# Altium schematic sheet STM-connections.SchDoc
size A4; Organization: Altium Limited; Address1: L3, 12a Rodborough Rd; Address2: Frenchs Forest; Address3: NSW; Address4: Australia 2086
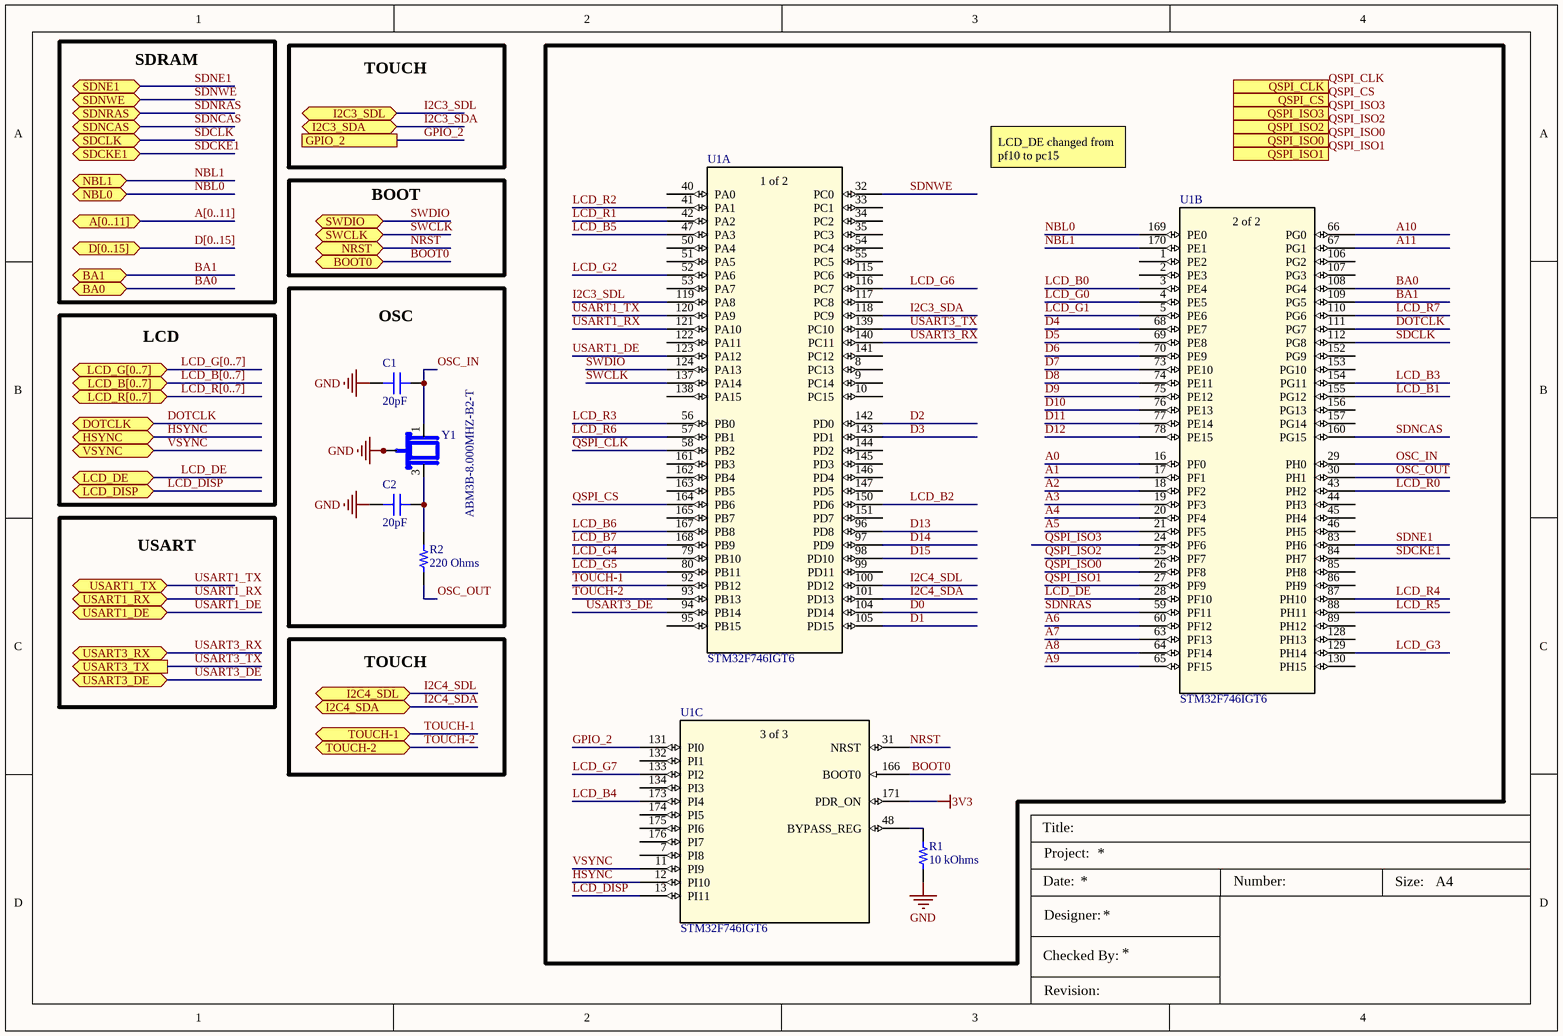
[diagram p0: STM-connections.SchDoc]

## Parts
C1  20pF  [CAP 0603_1608]
C2  20pF  [CAP 0603_1608]
R1  10 kOhms  [RES 0603_1608]
R2  220 Ohms  [RES 0603_1608]
U1  STM32F746IGT6  [LQFP176_24X24_STM]  (parts A,B,C of 4)
Y1  ABM3B-8.000MHZ-B2-T  [OSC_ABM3B-8.000MHZ-B2-T]

## Blocks framed on the sheet
OSC: C1 C2 R2 Y1

## Ports
A[0..11] (bidir), BA0 (bidir), BA1 (bidir), BOOT0 (bidir), D[0..15] (bidir), DOTCLK (bidir), GPIO_2, HSYNC (bidir), I2C3_SDA (bidir), I2C3_SDL (bidir), I2C4_SDA (bidir), I2C4_SDL (bidir), LCD_B[0..7] (bidir), LCD_DE (bidir), LCD_DISP (bidir), LCD_G[0..7] (bidir), LCD_R[0..7] (bidir), NBL0 (bidir), NBL1 (bidir), NRST (bidir), QSPI_CLK, QSPI_CS, QSPI_ISO0, QSPI_ISO1, QSPI_ISO2, QSPI_ISO3, SDCKE1 (bidir), SDCLK (bidir), SDNCAS (bidir), SDNE1 (bidir), SDNRAS (bidir), SDNWE (bidir), SWCLK (bidir), SWDIO (bidir), TOUCH-1 (bidir), TOUCH-2 (bidir), USART1_DE (bidir), USART1_RX (bidir), USART1_TX (bidir), USART3_DE (bidir), USART3_RX (bidir), USART3_TX (out), VSYNC (bidir)

## Nets
3V3: U1.171(PDR_ON)
GND: C1.1 C2.1 R1.1 Y1.2(GND) Y1.4(GND)
A0: U1.16(PF0)
A1: U1.17(PF1)
A2: U1.18(PF2)
A3: U1.19(PF3)
A4: U1.20(PF4)
A5: U1.21(PF5)
A6: U1.60(PF12)
A7: U1.63(PF13)
A8: U1.64(PF14)
A9: U1.65(PF15)
A10: U1.66(PG0)
A11: U1.67(PG1)
BA0: U1.108(PG4) ; port BA0
BA1: U1.109(PG5) ; port BA1
BOOT0: U1.166(BOOT0) ; port BOOT0
D0: U1.104(PD14)
D1: U1.105(PD15)
D2: U1.142(PD0)
D3: U1.143(PD1)
D4: U1.68(PE7)
D5: U1.69(PE8)
D6: U1.70(PE9)
D7: U1.73(PE10)
D8: U1.74(PE11)
D9: U1.75(PE12)
D10: U1.76(PE13)
D11: U1.77(PE14)
D12: U1.78(PE15)
D13: U1.96(PD8)
D14: U1.97(PD9)
D15: U1.98(PD10)
DOTCLK: U1.111(PG7) ; port DOTCLK
GPIO_2: U1.131(PI0) ; port GPIO_2
HSYNC: U1.12(PI10) ; port HSYNC
I2C3_SDA: U1.118(PC9) ; port I2C3_SDA
I2C3_SDL: U1.119(PA8) ; port I2C3_SDL
I2C4_SDA: U1.101(PD13) ; port I2C4_SDA
I2C4_SDL: U1.100(PD12) ; port I2C4_SDL
LCD_B0: U1.3(PE4)
LCD_B1: U1.155(PG12)
LCD_B2: U1.150(PD6)
LCD_B3: U1.154(PG11)
LCD_B4: U1.173(PI4)
LCD_B5: U1.47(PA3)
LCD_B6: U1.167(PB8)
LCD_B7: U1.168(PB9)
LCD_DE: U1.28(PF10) ; port LCD_DE
LCD_DISP: U1.13(PI11) ; port LCD_DISP
LCD_G0: U1.4(PE5)
LCD_G1: U1.5(PE6)
LCD_G2: U1.52(PA6)
LCD_G3: U1.129(PH14)
LCD_G4: U1.79(PB10)
LCD_G5: U1.80(PB11)
LCD_G6: U1.116(PC7)
LCD_G7: U1.133(PI2)
LCD_R0: U1.43(PH2)
LCD_R1: U1.42(PA2)
LCD_R2: U1.41(PA1)
LCD_R3: U1.56(PB0)
LCD_R4: U1.87(PH10)
LCD_R5: U1.88(PH11)
LCD_R6: U1.57(PB1)
LCD_R7: U1.110(PG6)
NBL0: U1.169(PE0) ; port NBL0
NBL1: U1.170(PE1) ; port NBL1
NRST: U1.31(NRST) ; port NRST
OSC_IN: C1.2 U1.29(PH0) Y1.1
OSC_OUT: R2.2 U1.30(PH1)
QSPI_CLK: U1.58(PB2) ; port QSPI_CLK
QSPI_CS: U1.164(PB6) ; port QSPI_CS
QSPI_ISO0: U1.26(PF8) ; port QSPI_ISO0
QSPI_ISO1: U1.27(PF9) ; port QSPI_ISO1
QSPI_ISO2: U1.25(PF7) ; port QSPI_ISO2
QSPI_ISO3: U1.24(PF6) ; port QSPI_ISO3
SDCKE1: U1.84(PH7) ; port SDCKE1
SDCLK: U1.112(PG8) ; port SDCLK
SDNCAS: U1.160(PG15) ; port SDNCAS
SDNE1: U1.83(PH6) ; port SDNE1
SDNRAS: U1.59(PF11) ; port SDNRAS
SDNWE: U1.32(PC0) ; port SDNWE
SWCLK: U1.137(PA14) ; port SWCLK
SWDIO: U1.124(PA13) ; port SWDIO
TOUCH-1: U1.92(PB12) ; port TOUCH-1
TOUCH-2: U1.93(PB13) ; port TOUCH-2
USART1_DE: U1.123(PA12) ; port USART1_DE
USART1_RX: U1.121(PA10) ; port USART1_RX
USART1_TX: U1.120(PA9) ; port USART1_TX
USART3_DE: U1.94(PB14) ; port USART3_DE
USART3_RX: U1.140(PC11) ; port USART3_RX
USART3_TX: U1.139(PC10) ; port USART3_TX
VSYNC: U1.11(PI9) ; port VSYNC
NetC2_2: C2.2 R2.1 Y1.3
NetR1_2: R1.2 U1.48(BYPASS_REG)

Not connected (* = marked no-connect by the designer): U1 1(PE2) 2(PE3) 7(PI8) 8(PC13) 9(PC14) 10(PC15) 33(PC1) 34(PC2) 35(PC3) 40(PA0) 44(PH3) 45(PH4) 46(PH5) 50(PA4) 51(PA5) 53(PA7) 54(PC4) 55(PC5) 85(PH8) 86(PH9) 89(PH12) 95(PB15) 99(PD11) 106(PG2) 107(PG3) 115(PC6) 117(PC8) 122(PA11) 128(PH13) 130(PH15) 132(PI1) 134(PI3) 138(PA15) 141(PC12) 144(PD2) 145(PD3) 146(PD4) 147(PD5) 151(PD7) 152(PG9) 153(PG10) 156(PG13) 157(PG14) 161(PB3) 162(PB4) 163(PB5) 165(PB7) 174(PI5) 175(PI6) 176(PI7)

## Buses and harness runs
bus A[0..11] = port A[0..11]
bus D[0..15] = port D[0..15]
bus LCD_B[0..7] = port LCD_B[0..7]
bus LCD_G[0..7] = port LCD_G[0..7]
bus LCD_R[0..7] = port LCD_R[0..7]

## Notes on the sheet
- SDRAM
- TOUCH
- LCD_DE changed from pf10 to pc15
- BOOT
- LCD
- USART
- Title:
- Project:
- Date:
- Designer:
- Number:
- Size:
- A4
- Checked By:
- Revision:
- (in symbol STM32F746IGT6, part A) 1 of 2
- (in symbol STM32F746IGT6, part B) 2 of 2
- (in symbol STM32F746IGT6, part C) 3 of 3

## Library data of the parts
C1 C2 = CC0603JRNPO0BN200: CAP CER 20PF 100V C0G/NPO 0603; Part Number: CC0603JRNPO0BN200; Value: 20pF
R1 = CRCW060310K0FKEAHP: RES SMD 10K OHM 1% 1/4W 0603; Part Number: CRCW060310K0FKEAHP; Value: 10 kOhms
R2 = CRCW0603220RJNEAHP: RES SMD 220 OHM 5% 1/4W 0603; Part Number: CRCW0603220RJNEAHP; Value: 220 Ohms
U1 = STM32F746IGT6: No Description Available; Built_By: EMA_Jessica; Vendor: STMicroelectronics; SourceLibrary: Add_to_database_2020-10-19; Copyright: Copyright (C) 2018 Accelerated Designs. All rights reserved; Manufacturer_Part_Number: STM32F746IGT6; RefDes: RefDes; Type: DEV
Y1 = ABM3B-8.000MHZ-B2-T: 8MHz Â±20ppm Crystal 18pF 200 Ohms 4-SMD, No Lead; MF: Abracon; Check_prices: https://www.snapeda.com/parts/ABM3B-8.000MHZ-B2-T/Abracon%20LLC/view-part/42698/?ref=eda; Price: None; SnapEDA_Link: https://www.snapeda.com/parts/ABM3B-8.000MHZ-B2-T/Abracon%20LLC/view-part/42698/?ref=snap; MP: ABM3B-8.000MHZ-B2-T; Value: *; Availability: Good; Package: SMD-4 Abracon LLC; Purchase-URL: https://pricing.snapeda.com/search/part/ABM3B-8.000MHZ-B2-T/?ref=eda